# EAGLE schematic M3020X (EAGLE 6.6.0)
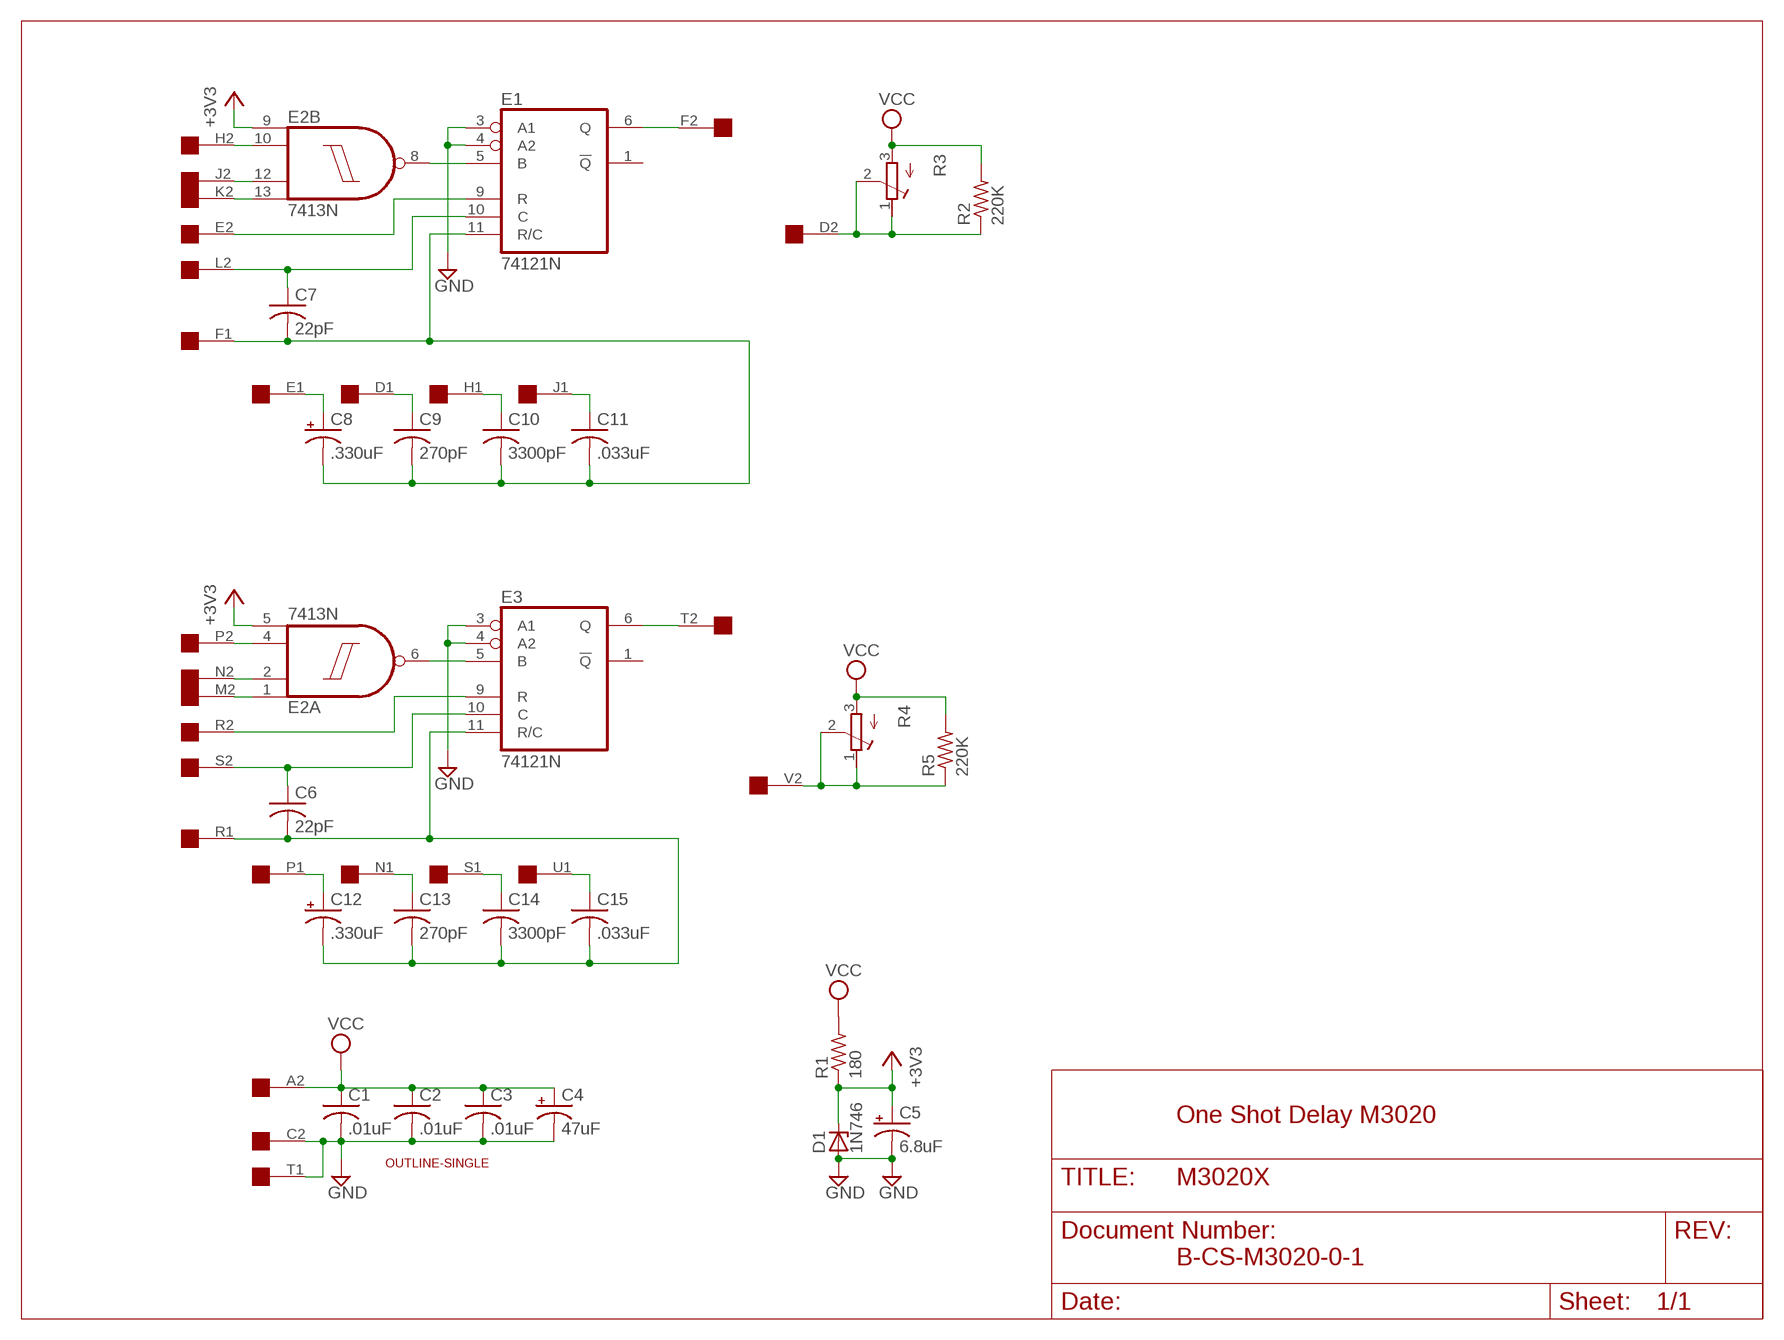
[diagram p0: schematic, sheet 1]

## Parts
C1  .01uF  C-US050-025X075  [C050-025X075]
C2  .01uF  C-US050-025X075  [C050-025X075]
C3  .01uF  C-US050-025X075  [C050-025X075]
C4  47uF  CPOL-USE20-8AXIAL  [E12-8]
C5  6.8uF  CPOL-USE20-8AXIAL  [E12-8]
C6  22pF  C-US050-025X075  [C050-025X075]
C7  22pF  C-US050-025X075  [C050-025X075]
C8  .330uF  CPOL-USE15-5AXIAL  [E15-5]
C9  270pF  C-US075-032X103  [C075-032X103]
C10  3300pF  C-US102-043X133  [C102-043X133]
C11  .033uF  C-US225-062X268  [C225-062X268]
C12  .330uF  CPOL-USE15-5AXIAL  [E15-5]
C13  270pF  C-US075-032X103  [C075-032X103]
C14  3300pF  C-US102-043X133  [C102-043X133]
C15  .033uF  C-US225-062X268  [C225-062X268]
D1  1N746  ZENER-DIODEDO35Z10  [DO35Z10]
E1  74121N  [DIL14]
E2  7413N  [DIL14]
E3  74121N  [DIL14]
R1  180  R-US_0207/10  [0207/10]
R2  220K  R-US_0207/10  [0207/10]
R3  275P  [3006Y]
R4  275P  [3006Y]
R5  220K  R-US_0207/10  [0207/10]
U$1  OUTLINE-SINGLE  [SINGLE]
U$2  SINGLE  [EDGE-CON2]

## Nets
+3V3: C5.+ D1.C E2.5(A:I3) E2.9(B:I0) R1.1
D1: C9.1 U$2.D1
D2: R2.1 R3.1(A) R3.2(S) U$2.D2
E1: C8.+ U$2.E1
E2: E1.9(R) U$2.E2
F1: C7.2 C8.- C9.2 C10.2 C11.2 E1.11(R/C) U$2.F1
F2: E1.6(Q) U$2.F2
GND: C1.2 C2.2 C3.2 C4.- C5.- D1.A E1.3(A1) E1.4(A2) E3.3(A1) E3.4(A2) U$2.C2 U$2.T1
H1: C10.1 U$2.H1
H2: E2.10(B:I1) U$2.H2
J1: C11.1 U$2.J1
J2: E2.12(B:I2) U$2.J2
K2: E2.13(B:I3) U$2.K2
L2: C7.1 E1.10(C) U$2.L2
M2: E2.1(A:I0) U$2.M2
N1: C13.1 U$2.N1
N2: E2.2(A:I1) U$2.N2
N$4: E2.6(A:O) E3.5(B)
N$5: E1.5(B) E2.8(B:O)
P1: C12.+ U$2.P1
P2: E2.4(A:I2) U$2.P2
R1: C6.2 C12.- C13.2 C14.2 C15.2 E3.11(R/C) U$2.R1
R2: E3.9(R) U$2.R2
S1: C14.1 U$2.S1
S2: C6.1 E3.10(C) U$2.S2
T2: E3.6(Q) U$2.T2
U1: C15.1 U$2.U1
V2: R4.1(A) R4.2(S) R5.1 U$2.V2
VCC: C1.1 C2.1 C3.1 C4.+ R1.2 R2.2 R3.3(E) R4.3(E) R5.2 U$2.A2
Unconnected: E1.1(!Q) E3.1(!Q) U$2.A1 U$2.B1 U$2.B2 U$2.C1 U$2.K1 U$2.L1 U$2.M1 U$2.U2 U$2.V1

## Notes on the sheet
- One Shot Delay M3020
- B-CS-M3020-0-1

## Power pins joined to a net without a drawn wire
GND: E1.7(GND) E2.7(P:GND) E3.7(GND)
VCC: E1.14(VCC) E2.14(P:VCC) E3.14(VCC)

## Library data of the parts
C1-C3 C6 C7 C9-C11 C13-C15 = rcl:C-US: CAPACITOR, American symbol
C4 C5 = dec-con:CPOL-USE20-8AXIAL: A 0.8 inch electrolytic.
C8 C12 = dec-con:CPOL-USE15-5AXIAL: 0.6" veresion of an electrolytic
D1 = diode:ZENER-DIODE: Z-Diode
E1 E3 = 74xx-us:74*121: Monostable MULTIVIBRATOR, schmitt trigger inputs
E2 = 74xx-us:74*13: Dual 4-input NAND schmitt trigger
R1 R2 R5 = rcl:R-US_: RESISTOR, American symbol
R3 R4 = dec-con:275P: Trimpot with 275P (3006Y) footprint.
U$1 = dec-con:OUTLINE-*: Board outlines for DEC boards.
U$2 = dec-con:SINGLE: Single-Height DEC board

## Net classes
0 default: width 0.813 mm